# EAGLE design Lampu Otomatis (EAGLE 7.2.0)
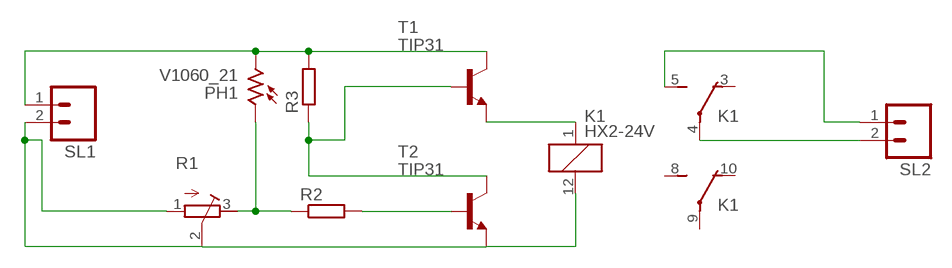
[diagram p0: schematic, sheet 1]

## Parts
K1  HX2-24V  [HX]
PH1  V1060_21  [TO-5_V10]
R1  R-TRIMM3339P  [RTRIM3339P]
R2  R-EU_0207/10  [0207/10]
R3  R-EU_0207/10  [0207/10]
SL1  M02  [02P]
SL2  M02  [02P]
T1  TIP31  [TO220]
T2  TIP31  [TO220]

## Nets
N$1: PH1.2 R3.2 SL1.1 T1.2(C)
N$2: K1.1 T1.3(E)
N$3: R2.2 T2.1(B)
N$4: PH1.1 R1.3(E) R2.1
N$5: R3.1 T1.1(B) T2.2(C)
N$6: K1.12 R1.1(A) R1.2(S) SL1.2 T2.3(E)
N$8: K1.5(2:S) SL2.1
N$10: K1.4(2:P) SL2.2
Unconnected: K1.3(2:O) K1.8(3:S) K1.9(3:P) K1.10(3:O)

## Library data of the parts
K1 = relay:HX2-*: Compact & Slim 2 Form C Non-polarized Relay NAiS Source: http://www.mew-europe.com/.. en_ds_61011_0000.pdf; OC_FARNELL: unknown; OC_NEWARK: unknown
PH1 = photo-elements:?1060*: Sensor Street Light control Source: http://optoelectronics.perkinelmer.com/content/Datasheets/DTS_PhotocellsB1060.pdf
R1 = resistor:R-TRIMM: Trimm resistor
R2 R3 = resistor:R-EU_: RESISTOR, European symbol
SL1 SL2 = con-amp-quick:M02: AMP QUICK CONNECTOR; OC_FARNELL: unknown; OC_NEWARK: unknown
T1 T2 = transistor:TIP31: NPN Transistor Medium Power Linear Switching Applications Source: http://onsemi.com

## Board
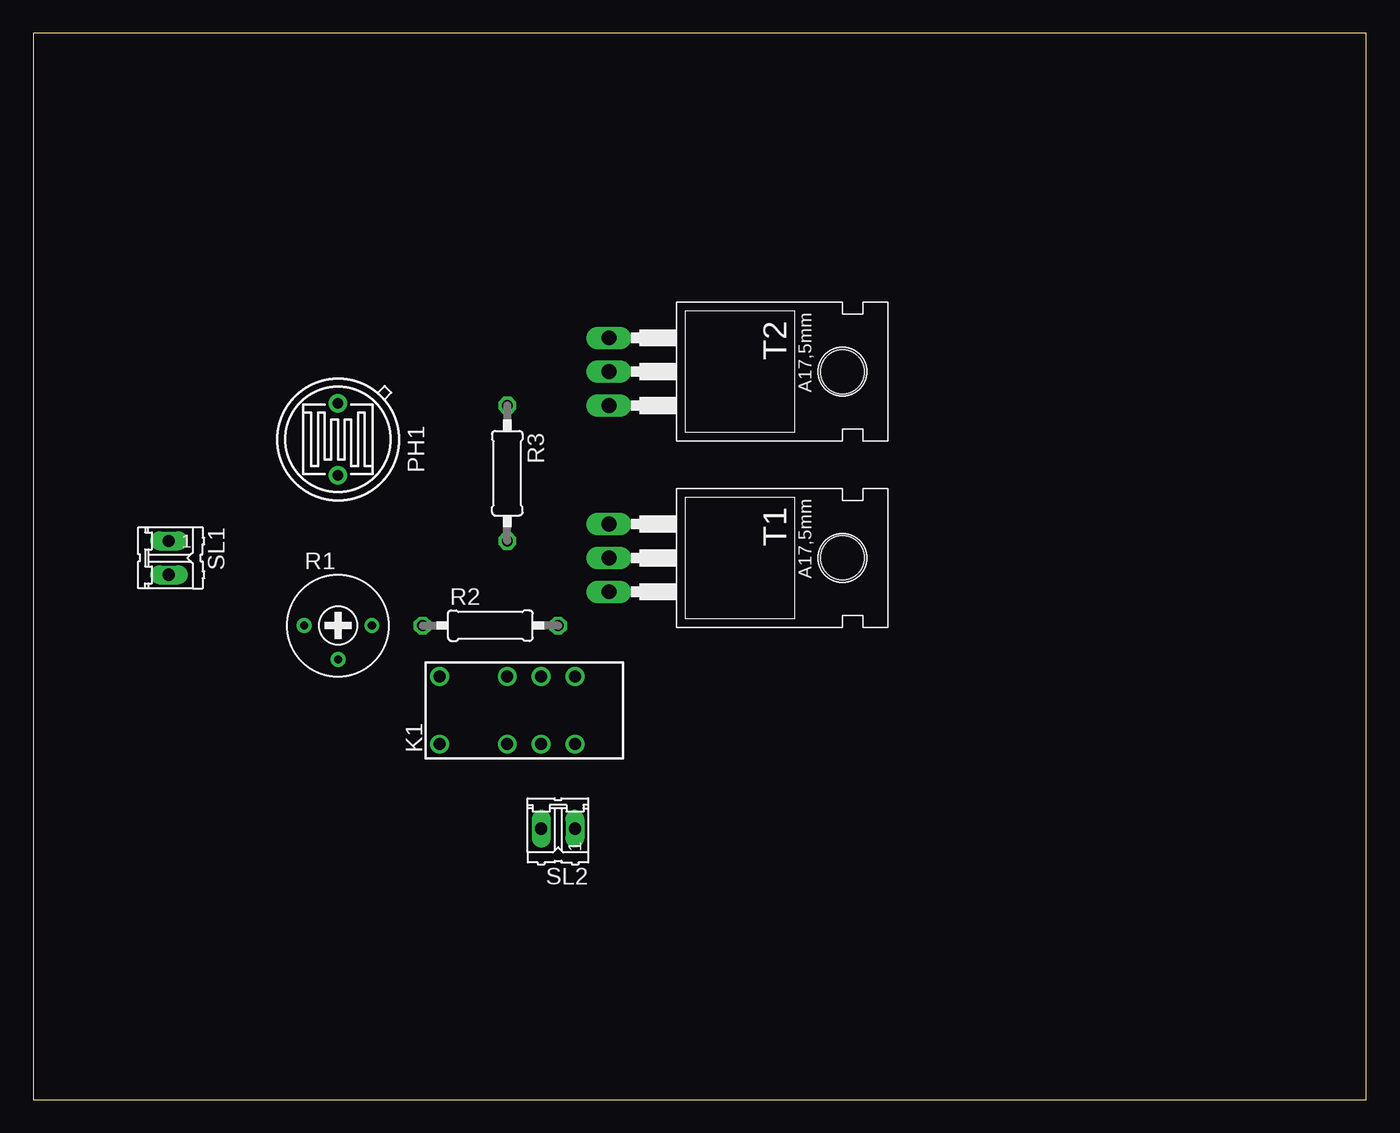
[diagram p1: board, top side]
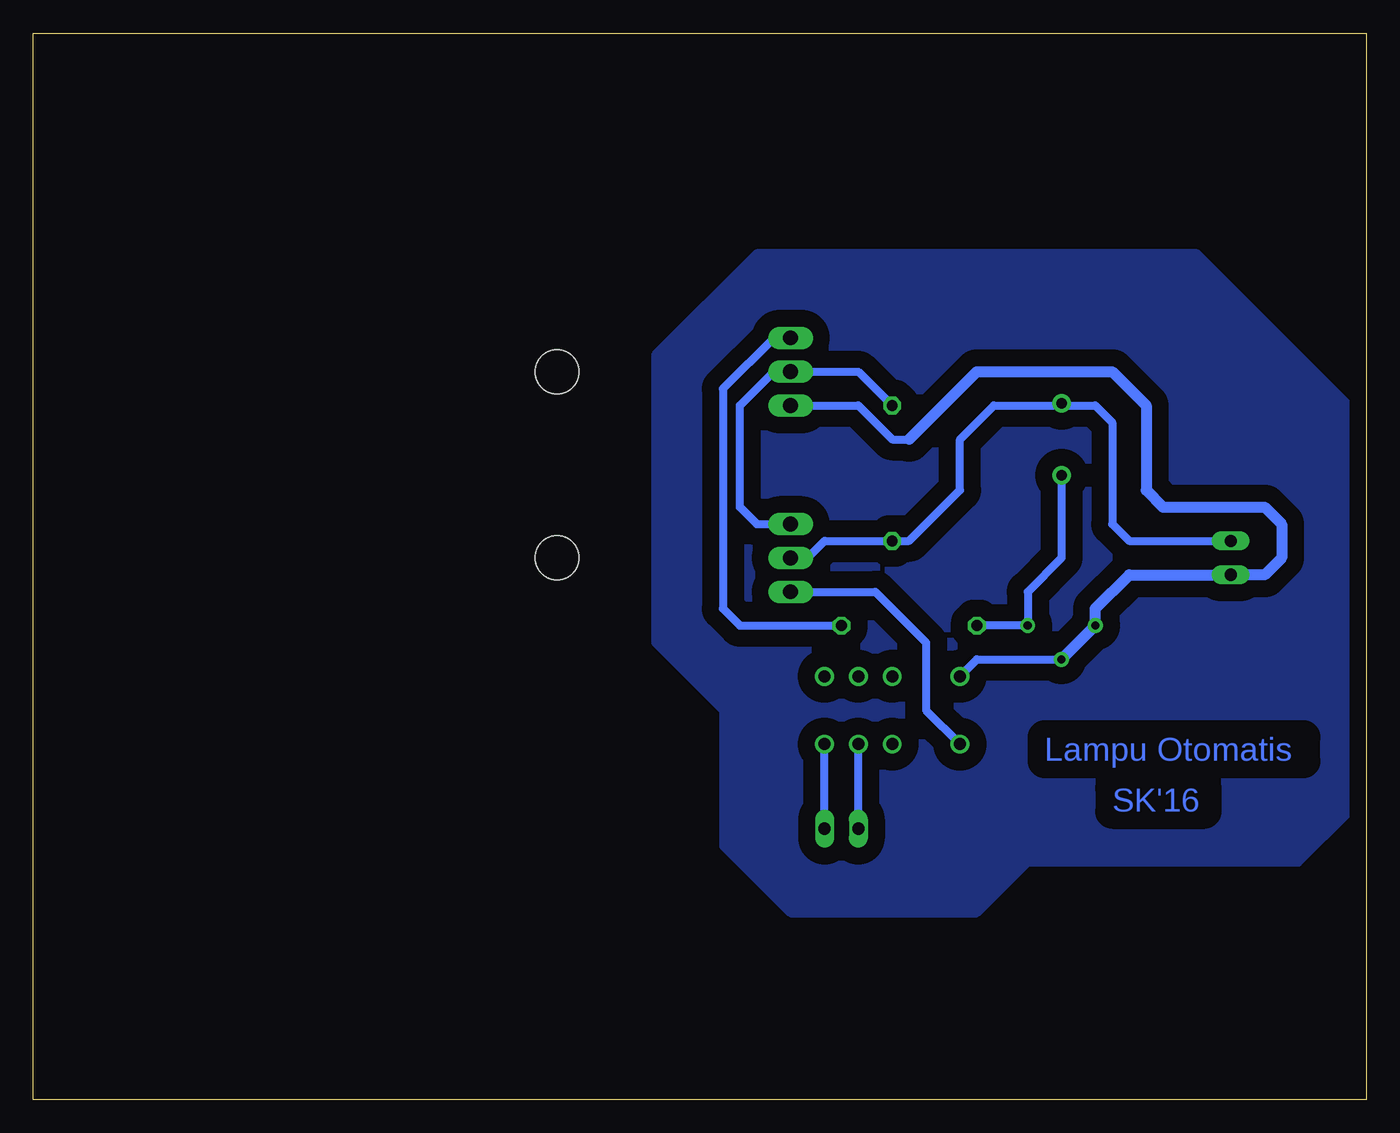
[diagram p2: board, bottom side, seen from below]

Size 100 x 80 mm. Coordinates in mm from the lower left corner, seen from the top.
Outline: 0,0 100,0 100,80 0,80 0,0
Copper layers (1*16): Top 0.035mm / dielectric 1.5mm / Bottom 0.035mm
Design rules "default": minimum track width 10mil, minimum drill 24mil, track to track 8mil, track to pad 8mil, pad to pad 8mil, via to via 8mil, smd to smd 8mil, copper to edge 40mil, drill to drill 8mil, minimum pad ring 10mil, minimum via ring 8mil, stop-mask expansion 4mil, vias tented up to drill 0mil, thermal gap 10mil

### Footprints (pad centres in the part's own frame; a part is rotated, then mirrored left to right if it is on the bottom)
HX = drill 0.9: 1 -6.35,-2.54; 3 -1.27,-2.54; 4 1.27,-2.54; 5 3.81,-2.54; 8 3.81,2.54; 9 1.27,2.54; 10 -1.27,2.54; 12 -6.35,2.54
TO-5_V10 = drill 0.8 pad 1.4: 1 -2.7,0; 2 2.7,0
RTRIM3339P = drill 0.61: 1 -2.54,0; 2 0,-2.54; 3 2.54,0
0207/10 = drill 0.813 octagon: 1 -5.08,0; 2 5.08,0
02P = drill 0.914 long: 1 -1.27,0; 2 1.27,0
TO220 = drill 1.118 long: 1 -2.54,-6.35; 2 0,-6.35; 3 2.54,-6.35 | hole 3.302: 0,11.176

### Placement (x,y rotation side)
K1  36.83,29.21 0 top
PH1  22.86,49.53 90 top
R1  22.86,35.56 0 top
R2  34.29,35.56 0 top
R3  35.56,46.99 270 top
SL1  10.16,40.64 270 top
SL2  39.37,20.32 180 top
T1  49.53,40.64 270 top
T2  49.53,54.61 270 top

### Tracks (layer width: path | path; a pad name or v marks a point on that pad's centre or on a via)
N$1
  Bottom 0.61: SL1.1 17.78,41.91 19.05,43.18 19.05,50.8 20.32,52.07 22.7,52.07 PH1.2 23.02,52.07 27.94,52.07 30.48,49.53 30.48,45.72 34.29,41.91 R3.2 40.64,41.91 41.91,40.64 T1.2
N$2
  Bottom 0.61: T1.3 36.83,38.1 33.02,34.29 33.02,29.21 K1.1
N$3
  Bottom 0.61: T2.1 44.45,57.15 48.26,53.34 48.26,36.83 46.99,35.56 R2.2
N$4
  Bottom 0.61: PH1.1 22.86,40.64 25.4,38.1 R1.3 R2.1
N$5
  Bottom 0.61: T1.1 45.72,43.18 46.99,44.45 46.99,52.07 44.45,54.61 T2.2 38.1,54.61 R3.1
N$6
  Bottom 0.61: T2.3 38.1,52.07 35.56,49.53 34.29,49.53 | K1.12 29.21,33.02 R1.2
  Bottom 0.813: R1.2 R1.1 20.32,36.83 17.78,39.37 SL1.2 7.62,39.37 6.35,40.64 6.35,43.18 7.62,44.45 15.24,44.45 16.51,45.72 16.51,52.07 19.05,54.61 29.21,54.61 34.29,49.53
N$8
  Bottom 0.61: SL2.1 K1.5
N$10
  Bottom 0.61: SL2.2 K1.4
N$11
  pour Bottom (isolate 1.27): 43.18,63.5 45.72,63.5 53.34,55.88 53.34,34.29 48.26,29.21 48.26,19.05 43.18,13.97 29.21,13.97 25.4,17.78 5.08,17.78 1.27,21.59 1.27,52.07 12.7,63.5

### Text on the board
Bottom: Lampu Otomatis | SK'16